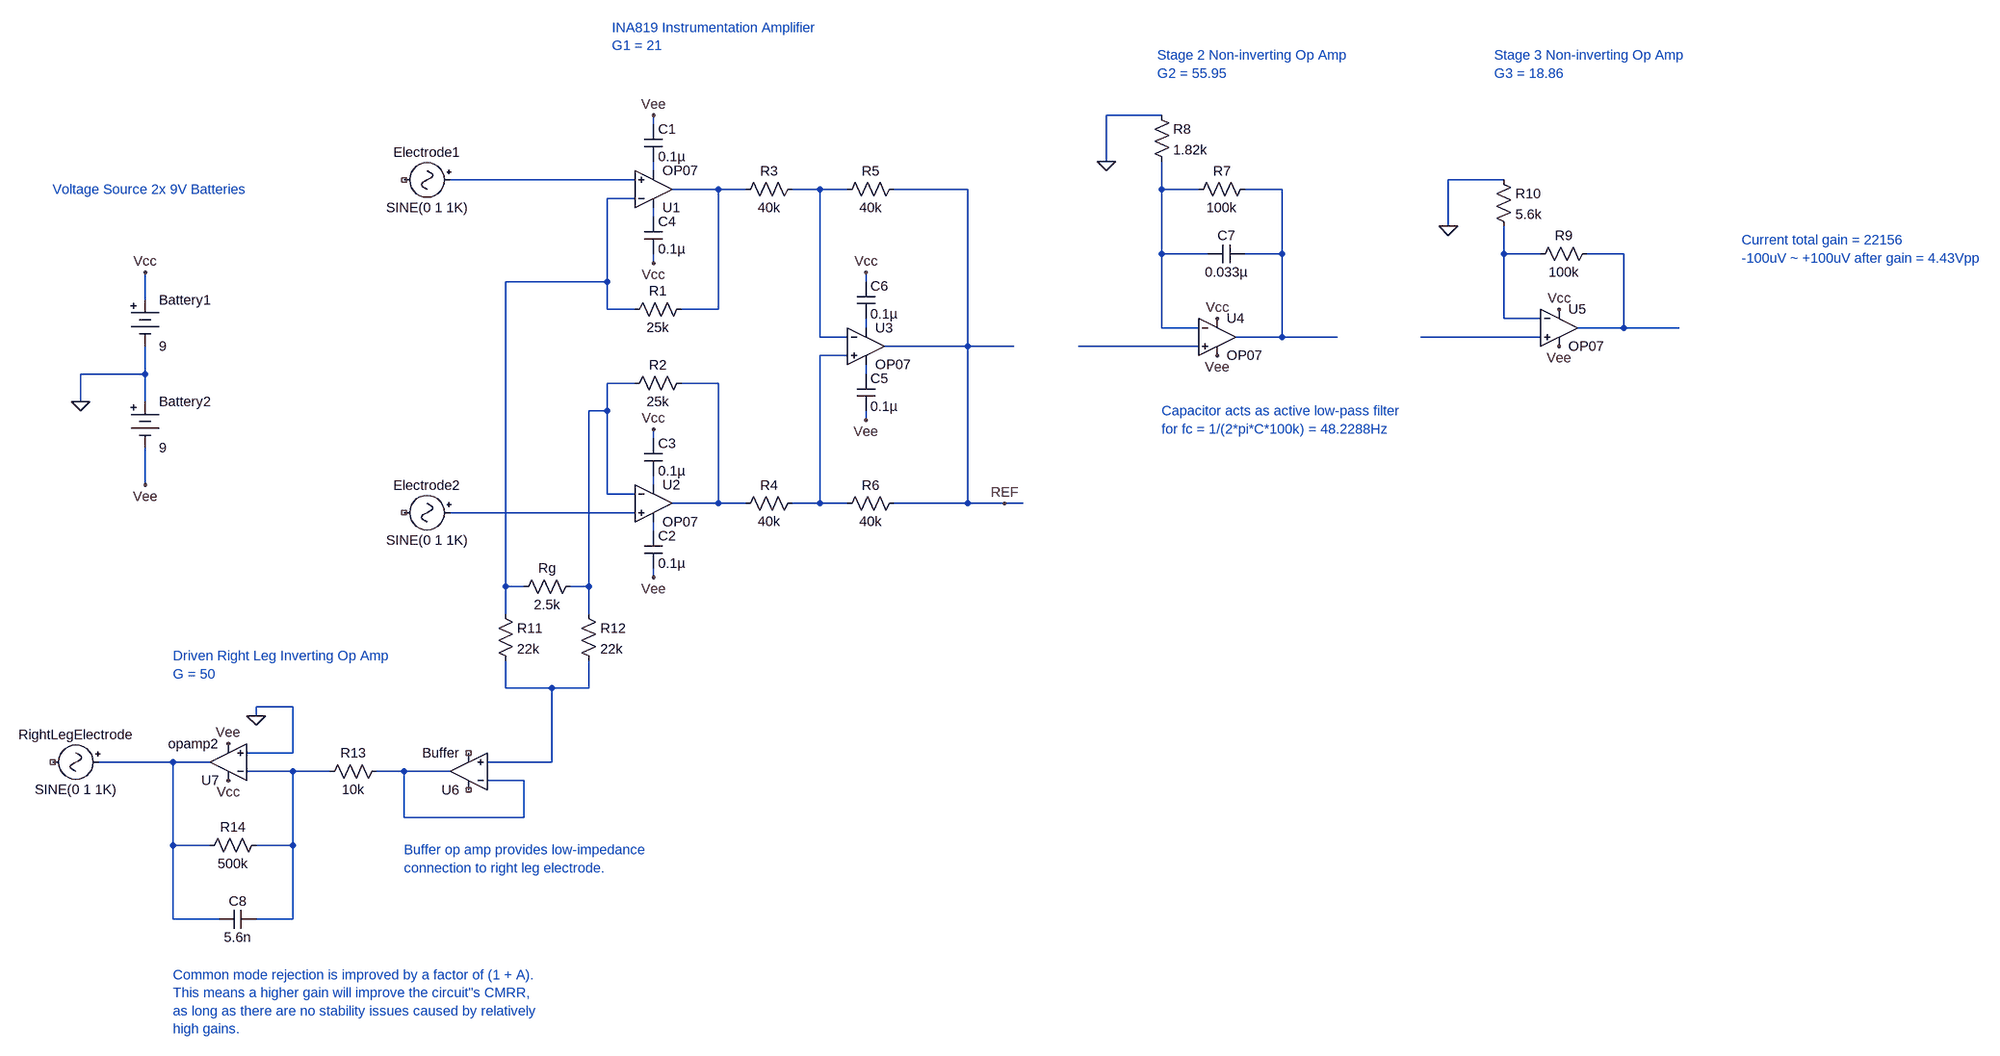
[diagram p0: schematic EEG Gain Stages.asc]
EEG Gain Stages.asc, the LTspice schematic file:
Version 4
SHEET 1 2612 1452
WIRE 960 -144 864 -144
WIRE 80 -128 80 -144
WIRE 864 -64 864 -144
WIRE 80 -48 80 -64
WIRE 48 -32 -272 -32
WIRE 1552 -32 1456 -32
WIRE 192 -16 112 -16
WIRE 240 -16 192 -16
WIRE 368 -16 320 -16
WIRE 416 -16 368 -16
WIRE 624 -16 496 -16
WIRE 960 -16 960 -64
WIRE 1024 -16 960 -16
WIRE 1168 -16 1104 -16
WIRE 48 0 0 0
WIRE 80 32 80 16
WIRE 1456 48 1456 -32
WIRE 960 96 960 -16
WIRE 1040 96 960 96
WIRE 1168 96 1168 -16
WIRE 1168 96 1104 96
WIRE 1552 96 1552 48
WIRE 1616 96 1552 96
WIRE 1760 96 1696 96
WIRE 80 112 80 96
WIRE 0 144 0 0
WIRE 0 144 -176 144
WIRE 448 144 448 128
WIRE -800 176 -800 128
WIRE 0 192 0 144
WIRE 48 192 0 192
WIRE 192 192 192 -16
WIRE 192 192 128 192
WIRE 1552 208 1552 96
WIRE 1616 208 1552 208
WIRE 448 224 448 208
WIRE 960 224 960 96
WIRE 1024 224 960 224
WIRE 1760 224 1760 96
WIRE 1760 224 1680 224
WIRE 1856 224 1760 224
WIRE 368 240 368 -16
WIRE 416 240 368 240
WIRE 1168 240 1168 96
WIRE 1168 240 1088 240
WIRE 1264 240 1168 240
WIRE 1616 240 1408 240
WIRE 624 256 624 -16
WIRE 624 256 480 256
WIRE 704 256 624 256
WIRE 1024 256 816 256
WIRE 416 272 368 272
WIRE -800 304 -800 256
WIRE -800 304 -912 304
WIRE 448 304 448 288
WIRE 48 320 0 320
WIRE 192 320 128 320
WIRE -912 352 -912 304
WIRE -800 352 -800 304
WIRE 0 368 0 320
WIRE 0 368 -32 368
WIRE 448 384 448 368
WIRE 80 416 80 400
WIRE -800 496 -800 432
WIRE 80 496 80 480
WIRE 0 512 0 368
WIRE 48 512 0 512
WIRE 192 528 192 320
WIRE 192 528 112 528
WIRE 240 528 192 528
WIRE 368 528 368 272
WIRE 368 528 320 528
WIRE 416 528 368 528
WIRE 624 528 624 256
WIRE 624 528 496 528
WIRE 688 528 624 528
WIRE 720 528 688 528
WIRE 48 544 -272 544
WIRE 80 576 80 560
WIRE 80 656 80 640
WIRE -176 672 -176 144
WIRE -144 672 -176 672
WIRE -32 672 -32 368
WIRE -32 672 -64 672
WIRE -176 720 -176 672
WIRE -32 720 -32 672
WIRE -176 848 -176 800
WIRE -96 848 -176 848
WIRE -32 848 -32 800
WIRE -32 848 -96 848
WIRE -544 880 -608 880
WIRE -608 896 -608 880
WIRE -544 960 -544 880
WIRE -544 960 -624 960
WIRE -752 976 -880 976
WIRE -688 976 -752 976
WIRE -96 976 -96 848
WIRE -96 976 -208 976
WIRE -544 992 -624 992
WIRE -480 992 -544 992
WIRE -352 992 -400 992
WIRE -272 992 -352 992
WIRE -144 1008 -208 1008
WIRE -352 1072 -352 992
WIRE -144 1072 -144 1008
WIRE -144 1072 -352 1072
WIRE -752 1120 -752 976
WIRE -688 1120 -752 1120
WIRE -544 1120 -544 992
WIRE -544 1120 -608 1120
WIRE -752 1248 -752 1120
WIRE -672 1248 -752 1248
WIRE -544 1248 -544 1120
WIRE -544 1248 -608 1248
FLAG -912 352 0
FLAG -800 128 Vcc
FLAG -800 496 Vee
FLAG 80 -144 Vee
FLAG 80 112 Vcc
FLAG 448 128 Vcc
FLAG 448 384 Vee
FLAG 80 400 Vcc
FLAG 80 656 Vee
FLAG 688 528 REF
FLAG 1056 208 Vcc
FLAG 1056 272 Vee
FLAG 864 -64 0
FLAG 1648 192 Vcc
FLAG 1648 256 Vee
FLAG 1456 48 0
FLAG -608 896 0
FLAG -656 1008 Vcc
FLAG -656 944 Vee
SYMBOL OpAmps\\OP07 80 48 M180
SYMATTR InstName U1
SYMBOL OpAmps\\OP07 80 464 R0
SYMATTR InstName U2
SYMBOL res 144 176 R90
WINDOW 0 0 56 VBottom 2
WINDOW 3 32 56 VTop 2
SYMATTR InstName R1
SYMATTR Value 25k
SYMBOL res 144 304 R90
WINDOW 0 0 56 VBottom 2
WINDOW 3 32 56 VTop 2
SYMATTR InstName R2
SYMATTR Value 25k
SYMBOL res 336 -32 R90
WINDOW 0 0 56 VBottom 2
WINDOW 3 32 56 VTop 2
SYMATTR InstName R3
SYMATTR Value 40k
SYMBOL res 336 512 R90
WINDOW 0 0 56 VBottom 2
WINDOW 3 32 56 VTop 2
SYMATTR InstName R4
SYMATTR Value 40k
SYMBOL OpAmps\\OP07 448 192 R0
SYMATTR InstName U3
SYMBOL res 512 -32 R90
WINDOW 0 0 56 VBottom 2
WINDOW 3 32 56 VTop 2
SYMATTR InstName R5
SYMATTR Value 40k
SYMBOL res 512 512 R90
WINDOW 0 0 56 VBottom 2
WINDOW 3 32 56 VTop 2
SYMATTR InstName R6
SYMATTR Value 40k
SYMBOL res -48 656 R90
WINDOW 0 0 56 VBottom 2
WINDOW 3 32 56 VTop 2
SYMATTR InstName Rg
SYMATTR Value 2.5k
SYMBOL cap 64 -128 R0
SYMATTR InstName C1
SYMATTR Value 0.1µ
SYMBOL cap 64 576 R0
SYMATTR InstName C2
SYMATTR Value 0.1µ
SYMBOL cap 64 416 R0
SYMATTR InstName C3
SYMATTR Value 0.1µ
SYMBOL cap 64 32 R0
SYMATTR InstName C4
SYMATTR Value 0.1µ
SYMBOL cap 432 304 R0
SYMATTR InstName C5
SYMATTR Value 0.1µ
SYMBOL cap 432 144 R0
SYMATTR InstName C6
SYMATTR Value 0.1µ
SYMBOL OpAmps\\OP07 1056 176 R0
SYMATTR InstName U4
SYMBOL res 1120 -32 R90
WINDOW 0 0 56 VBottom 2
WINDOW 3 32 56 VTop 2
SYMATTR InstName R7
SYMATTR Value 100k
SYMBOL res 944 -160 R0
SYMATTR InstName R8
SYMATTR Value 1.82k
SYMBOL OpAmps\\OP07 1648 160 R0
SYMATTR InstName U5
SYMBOL res 1712 80 R90
WINDOW 0 0 56 VBottom 2
WINDOW 3 32 56 VTop 2
SYMATTR InstName R9
SYMATTR Value 100k
SYMBOL res 1536 -48 R0
SYMATTR InstName R10
SYMATTR Value 5.6k
SYMBOL cap 1104 80 R90
WINDOW 0 0 32 VBottom 2
WINDOW 3 32 32 VTop 2
SYMATTR InstName C7
SYMATTR Value 0.033µ
SYMBOL OpAmps\\opamp2 -240 1056 R180
SYMATTR InstName U6
SYMATTR Value Buffer
SYMBOL res -192 704 R0
SYMATTR InstName R11
SYMATTR Value 22k
SYMBOL res -48 704 R0
SYMATTR InstName R12
SYMATTR Value 22k
SYMBOL OpAmps\\opamp2 -656 1040 R180
SYMATTR InstName U7
SYMBOL res -384 976 R90
WINDOW 0 0 56 VBottom 2
WINDOW 3 32 56 VTop 2
SYMATTR InstName R13
SYMATTR Value 10k
SYMBOL res -592 1104 R90
WINDOW 0 0 56 VBottom 2
WINDOW 3 32 56 VTop 2
SYMATTR InstName R14
SYMATTR Value 500k
SYMBOL cap -608 1232 R90
WINDOW 0 0 32 VBottom 2
WINDOW 3 32 32 VTop 2
SYMATTR InstName C8
SYMATTR Value 5.6n
SYMBOL Misc\\battery -800 160 R0
SYMATTR InstName Battery1
SYMATTR Value 9
SYMBOL Misc\\battery -800 336 R0
SYMATTR InstName Battery2
SYMATTR Value 9
SYMBOL Misc\\signal -256 -32 R90
WINDOW 0 -32 56 VBottom 2
WINDOW 3 32 56 VTop 2
SYMATTR InstName Electrode1
SYMBOL Misc\\signal -256 544 R90
WINDOW 0 -32 56 VBottom 2
WINDOW 3 32 56 VTop 2
SYMATTR InstName Electrode2
SYMBOL Misc\\signal -864 976 R90
WINDOW 0 -32 56 VBottom 2
WINDOW 3 32 56 VTop 2
SYMATTR InstName RightLegElectrode
TEXT 8 -296 Left 2 ;INA819 Instrumentation Amplifier\nG1 = 21
TEXT 952 -248 Left 2 ;Stage 2 Non-inverting Op Amp\nG2 = 55.95
TEXT -960 -16 Left 2 ;Voltage Source 2x 9V Batteries
TEXT 1536 -248 Left 2 ;Stage 3 Non-inverting Op Amp\nG3 = 18.86
TEXT 1984 72 Left 2 ;Current total gain = 22156\n-100uV ~ +100uV after gain = 4.43Vpp
TEXT 960 368 Left 2 ;Capacitor acts as active low-pass filter \nfor fc = 1/(2*pi*C*100k) = 48.2288Hz
TEXT -752 1344 Left 2 ;Common mode rejection is improved by a factor of (1 + A). \nThis means a higher gain will improve the circuit"s CMRR, \nas long as there are no stability issues caused by relatively \nhigh gains.
TEXT -752 792 Left 2 ;Driven Right Leg Inverting Op Amp\nG = 50
TEXT -352 1128 Left 2 ;Buffer op amp provides low-impedance\nconnection to right leg electrode.

The netlist it stands for:
* EEG Gain Stages.asc
XU1 N002 N007 N008 N001 N003 LT1001  ; OP07, pins In+ In- V+ V- OUT
XU2 N019 N016 N018 N020 N017 LT1001  ; OP07, pins In+ In- V+ V- OUT
R1 N003 N007 25k
R2 N017 N016 25k
R3 N004 N003 40k
R4 N014 N017 40k
XU3 N014 N004 N011 N015 REF LT1001  ; OP07, pins In+ In- V+ V- OUT
R5 REF N004 40k
R6 REF N014 40k
Rg N016 N007 2.5k
C1 Vee N001 0.1µ
C2 N020 Vee 0.1µ
C3 Vcc N018 0.1µ
C4 N008 Vcc 0.1µ
C5 N015 Vee 0.1µ
C6 Vcc N011 0.1µ
XU4 N013 N005 Vcc Vee N006 LT1001  ; OP07, pins In+ In- V+ V- OUT
R7 N006 N005 100k
R8 0 N005 1.82k
XU5 N012 N009 Vcc Vee N010 LT1001  ; OP07, pins In+ In- V+ V- OUT
R9 N010 N009 100k
R10 0 N009 5.6k
C7 N006 N005 0.033µ
XU6 N021 N024 NC_01 NC_02 N024 Buffer  ; pins In+ In- V+ V- OUT
R11 N007 N021 22k
R12 N016 N021 22k
XU7 0 N023 Vcc Vee N022 opamp2  ; pins In+ In- V+ V- OUT
R13 N024 N023 10k
R14 N023 N022 500k
C8 N023 N022 5.6n
V§Battery1 Vcc 0 9
V§Battery2 0 Vee 9
V§Electrode1 N002 NC_03 SINE(0 1 1K)
V§Electrode2 N019 NC_04 SINE(0 1 1K)
V§RightLegElectrode N022 NC_05 SINE(0 1 1K)
* INA819 Instrumentation Amplifier
* G1 = 21
* Stage 2 Non-inverting Op Amp
* G2 = 55.95
* Voltage Source 2x 9V Batteries
* Stage 3 Non-inverting Op Amp
* G3 = 18.86
* Current total gain = 22156
* -100uV ~ +100uV after gain = 4.43Vpp
* Capacitor acts as active low-pass filter
* for fc = 1/(2*pi*C*100k) = 48.2288Hz
* Common mode rejection is improved by a factor of (1 + A).
* This means a higher gain will improve the circuit"s CMRR,
* as long as there are no stability issues caused by relatively
* high gains.
* Driven Right Leg Inverting Op Amp
* G = 50
* Buffer op amp provides low-impedance
* connection to right leg electrode.
.lib LTC.lib
.backanno
.end